# Altium schematic sheet Splitter.SchDoc: LiveDesign Evaluation - Countdown
size A4; Organization: Altium Limited; Address1: L3, 12a Rodborough Rd; Address2: Frenchs Forest; Address3: NSW; Address4: Australia 2086; DocumentNumber: 3; SheetNumber: 3; SheetTotal: 3
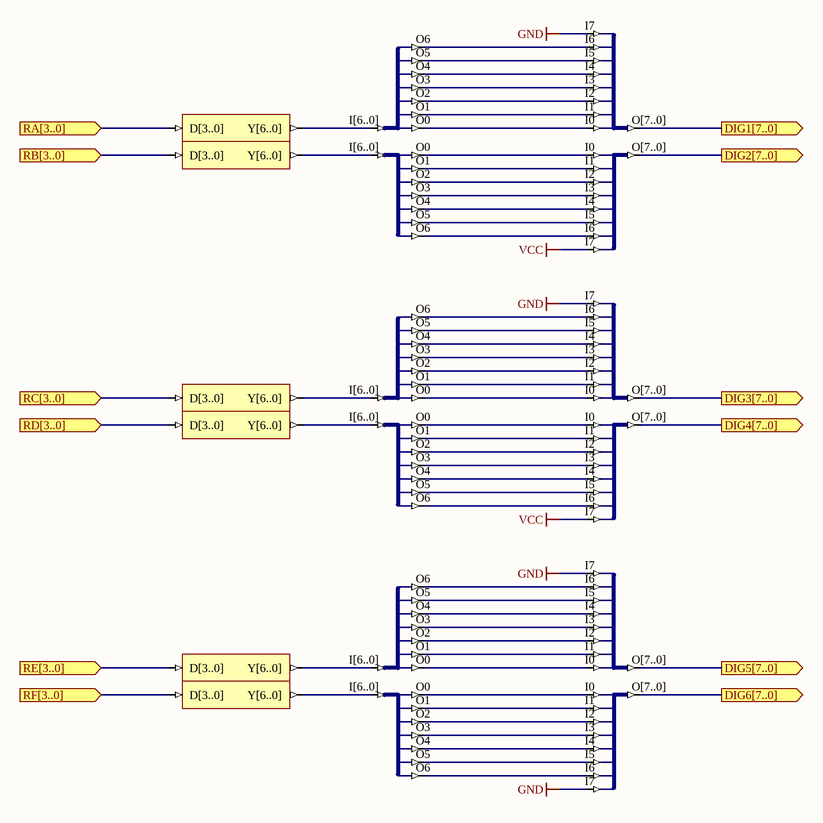
[diagram p0: Splitter.SchDoc]

## Parts
U30  J8S_8B  (value not drawn)
U31  J8S_8B  (value not drawn)
U32  J8S_8B  (value not drawn)
U33  J8S_8B  (value not drawn)
U34  J8S_8B  (value not drawn)
U35  J8S_8B  (value not drawn)
U36  J7B_7S  (value not drawn)
U37  J7B_7S  (value not drawn)
U38  J7B_7S  (value not drawn)
U39  J7B_7S  (value not drawn)
U40  J7B_7S  (value not drawn)
U41  J7B_7S  (value not drawn)
U42  D7SEGB  (value not drawn)
U43  D7SEGB  (value not drawn)
U44  D7SEGB  (value not drawn)
U45  D7SEGB  (value not drawn)
U46  D7SEGB  (value not drawn)
U47  D7SEGB  (value not drawn)

## Ports
DIG1[7..0] (out), DIG2[7..0] (out), DIG3[7..0] (out), DIG4[7..0] (out), DIG5[7..0] (out), DIG6[7..0] (out), RA[3..0] (in), RB[3..0] (in), RC[3..0] (in), RD[3..0] (in), RE[3..0] (in), RF[3..0] (in)

## Nets
GND: U30.I7 U32.I7 U34.I7 U35.I7
VCC: U31.I7 U33.I7
DIG1[7..0]: U30.O[7..0] ; port DIG1[7..0]
DIG2[7..0]: U31.O[7..0] ; port DIG2[7..0]
DIG3[7..0]: U32.O[7..0] ; port DIG3[7..0]
DIG4[7..0]: U33.O[7..0] ; port DIG4[7..0]
DIG5[7..0]: U34.O[7..0] ; port DIG5[7..0]
DIG6[7..0]: U35.O[7..0] ; port DIG6[7..0]
RA[3..0]: U42.D[3..0] ; port RA[3..0]
RB[3..0]: U43.D[3..0] ; port RB[3..0]
RC[3..0]: U44.D[3..0] ; port RC[3..0]
RD[3..0]: U45.D[3..0] ; port RD[3..0]
RE[3..0]: U46.D[3..0] ; port RE[3..0]
RF[3..0]: U47.D[3..0] ; port RF[3..0]
NetU30_I0: U30.I0 U36.O0
NetU30_I1: U30.I1 U36.O1
NetU30_I2: U30.I2 U36.O2
NetU30_I3: U30.I3 U36.O3
NetU30_I4: U30.I4 U36.O4
NetU30_I5: U30.I5 U36.O5
NetU30_I6: U30.I6 U36.O6
NetU31_I0: U31.I0 U37.O0
NetU31_I1: U31.I1 U37.O1
NetU31_I2: U31.I2 U37.O2
NetU31_I3: U31.I3 U37.O3
NetU31_I4: U31.I4 U37.O4
NetU31_I5: U31.I5 U37.O5
NetU31_I6: U31.I6 U37.O6
NetU32_I0: U32.I0 U38.O0
NetU32_I1: U32.I1 U38.O1
NetU32_I2: U32.I2 U38.O2
NetU32_I3: U32.I3 U38.O3
NetU32_I4: U32.I4 U38.O4
NetU32_I5: U32.I5 U38.O5
NetU32_I6: U32.I6 U38.O6
NetU33_I0: U33.I0 U39.O0
NetU33_I1: U33.I1 U39.O1
NetU33_I2: U33.I2 U39.O2
NetU33_I3: U33.I3 U39.O3
NetU33_I4: U33.I4 U39.O4
NetU33_I5: U33.I5 U39.O5
NetU33_I6: U33.I6 U39.O6
NetU34_I0: U34.I0 U40.O0
NetU34_I1: U34.I1 U40.O1
NetU34_I2: U34.I2 U40.O2
NetU34_I3: U34.I3 U40.O3
NetU34_I4: U34.I4 U40.O4
NetU34_I5: U34.I5 U40.O5
NetU34_I6: U34.I6 U40.O6
NetU35_I0: U35.I0 U41.O0
NetU35_I1: U35.I1 U41.O1
NetU35_I2: U35.I2 U41.O2
NetU35_I3: U35.I3 U41.O3
NetU35_I4: U35.I4 U41.O4
NetU35_I5: U35.I5 U41.O5
NetU35_I6: U35.I6 U41.O6
NetU36_I[6..0]: U36.I[6..0] U42.Y[6..0]
NetU37_I[6..0]: U37.I[6..0] U43.Y[6..0]
NetU38_I[6..0]: U38.I[6..0] U44.Y[6..0]
NetU39_I[6..0]: U39.I[6..0] U45.Y[6..0]
NetU40_I[6..0]: U40.I[6..0] U46.Y[6..0]
NetU41_I[6..0]: U41.I[6..0] U47.Y[6..0]

## Notes on the sheet
- Title
- Size:
- Date:
- A4
- Number:
- Time:
- Revision:
- Sheet
- of
- File:

## Library data of the parts
U30-U35 = J8S_8B: 8 Single pin inputs to single 8-Bit output bus; FunctionalClass: Bus Joiner; PortSize: 8; ArchiveName: GENERIC; VHDLIB_SIM: GENERIC_LIB; Published: 29-Jan-2004; Publisher: Altium Limited; LastRevisionNo: 1.00.00; HelpURL: CR0118 FPGA Generic Library Guide.pdf#page=305
U36-U41 = J7B_7S: 7-Bit input bus to 7 Single pin outputs; FunctionalClass: Bus Joiner; PortSize: 7; ArchiveName: GENERIC; VHDLIB_SIM: GENERIC_LIB; Published: 29-Jan-2004; Publisher: Altium Limited; LastRevisionNo: 1.00.00; HelpURL: CR0118 FPGA Generic Library Guide.pdf#page=303
U42-U47 = D7SEGB: 7-Segment-Display Decoder for Common-Cathode LED (Active High Output), Bus Version; ArchiveName: GENERIC; VHDLIB_SIM: GENERIC_LIB; Published: 29-Jan-2004; Publisher: Altium Limited; Core Revision: 1.00.00